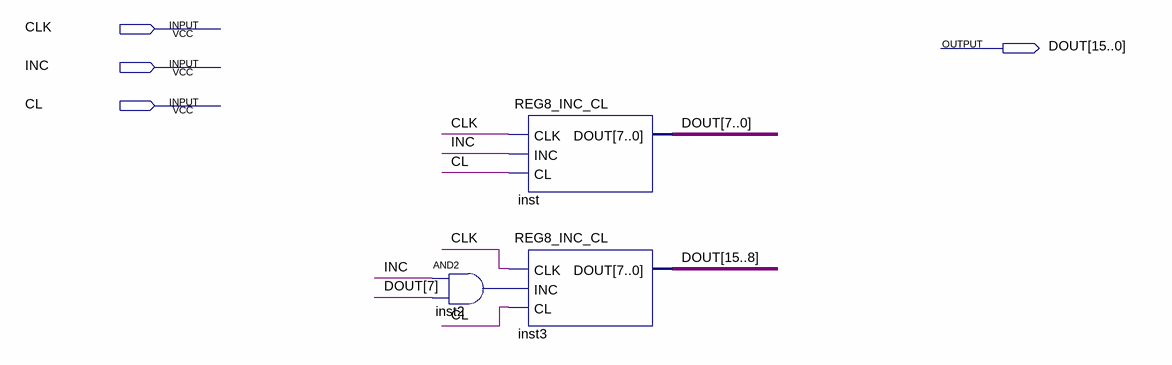
[diagram p0: schematic sheet]
// Quartus schematic REG16_INC_CL.bdf as structural Verilog: 3 symbols, 4 pins
module REG16_INC_CL (
  input  CLK,
  input  INC,
  input  CL,
  output [15:0] DOUT
);

  wire inst2_out;

  and inst2 (inst2_out, INC, DOUT[7]);
  REG8_INC_CL inst (.CLK(CLK), .INC(INC), .CL(CL), .DOUT(DOUT[7:0]));
  REG8_INC_CL inst3 (.CLK(CLK), .INC(inst2_out), .CL(CL), .DOUT(DOUT[15:8]));
endmodule
